# EAGLE design w65c265sxb_ym2149_rev1 (EAGLE 9.6.2)
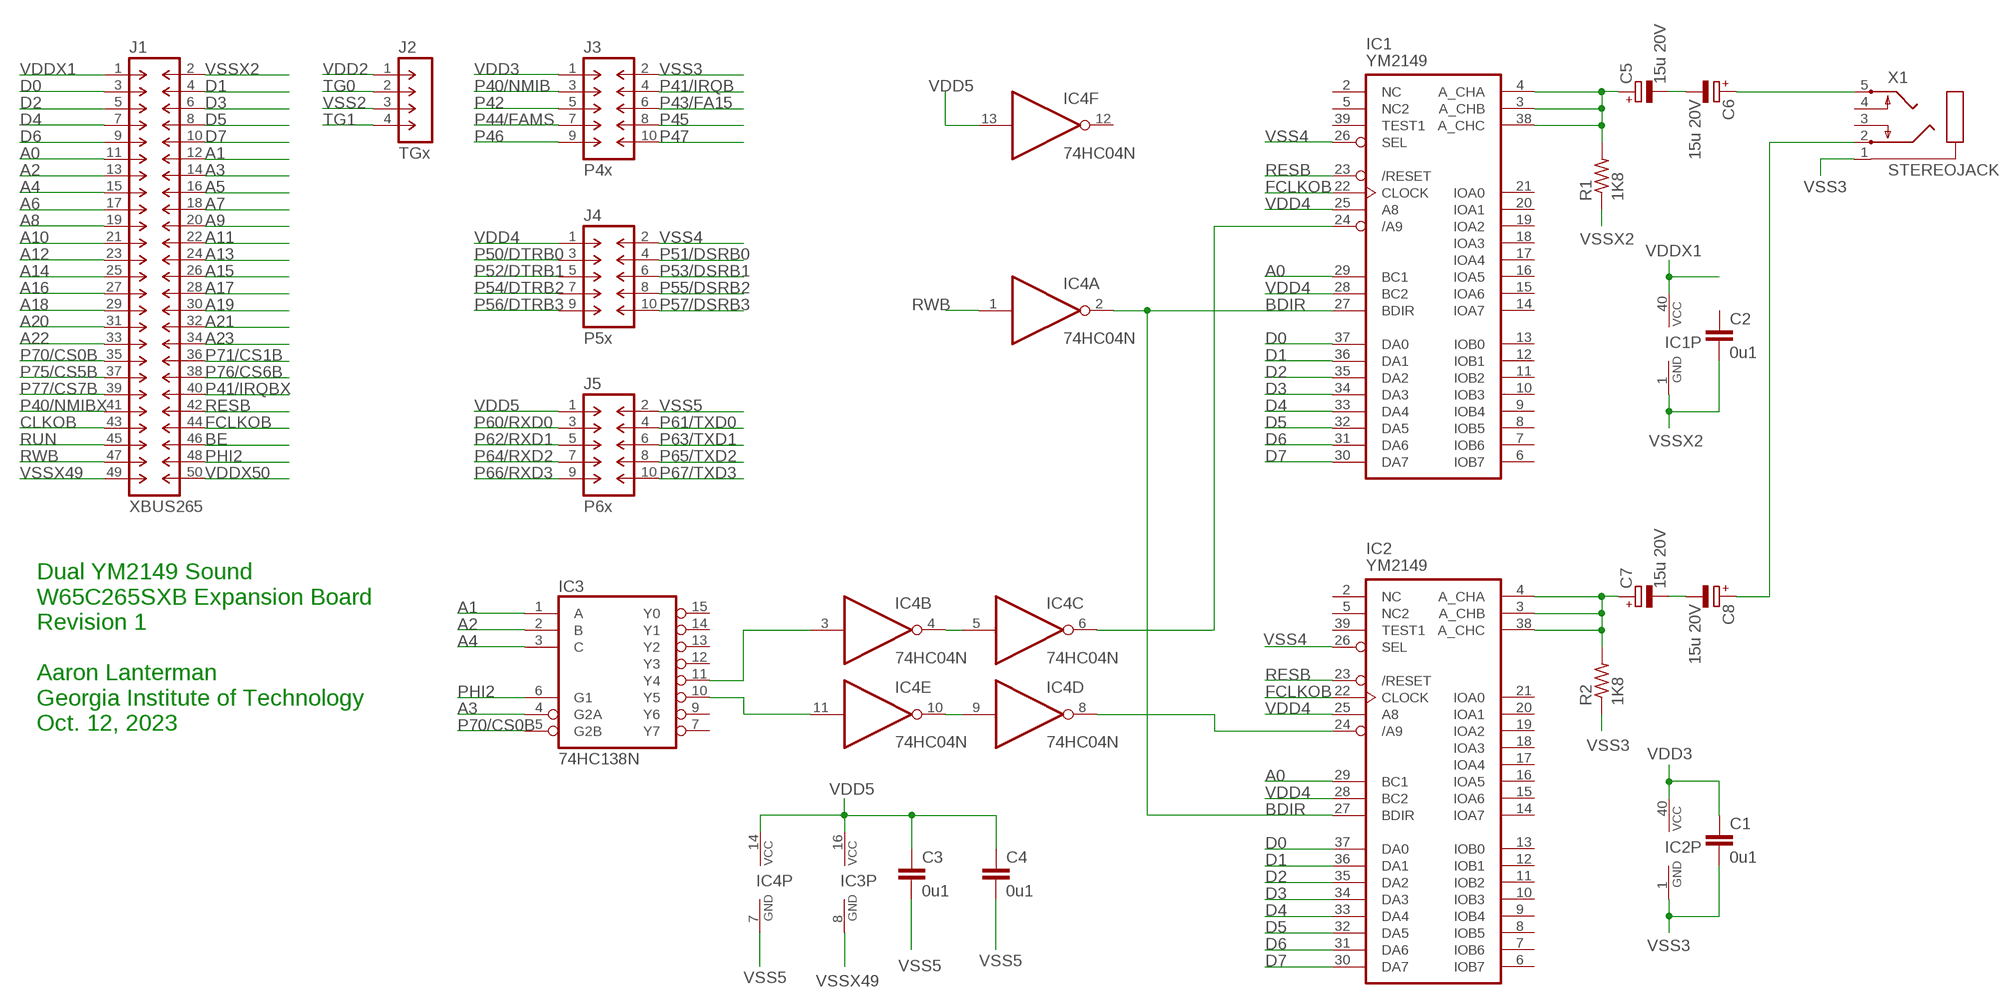
[diagram p0: schematic, sheet 1]

## Parts
C1  0u1  C-EU050-025X075-AARON  [C050-025X075-AARON]
C2  0u1  C-EU050-025X075-AARON  [C050-025X075-AARON]
C3  0u1  C-EU050-025X075-AARON  [C050-025X075-AARON]
C4  0u1  C-EU050-025X075-AARON  [C050-025X075-AARON]
C5  15u 20V  CPOL-EUE2.5-7  [E2,5-7]
C6  15u 20V  CPOL-EUE2.5-7  [E2,5-7]
C7  15u 20V  CPOL-EUE2.5-7  [E2,5-7]
C8  15u 20V  CPOL-EUE2.5-7  [E2,5-7]
IC1  YM2149  [DIL40]
IC2  YM2149  [DIL40]
IC3  74HC138N  [DIL16]
IC4  74HC04N  [DIL14]
J1  XBUS265  M-2X25-DIL-100  [DIL-100-2X25]
J2  TGx  M-1X04-SIP-100-40  [SIP-100-04-40]
J3  P4x  M-2X05-DIL-100  [DIL-100-2X05]
J4  P5x  M-2X05-DIL-100  [DIL-100-2X05]
J5  P6x  M-2X05-DIL-100  [DIL-100-2X05]
R1  1K8  R-US_0207/10  [0207/10]
R2  1K8  R-US_0207/10  [0207/10]
X1  STEREOJACK  [STX3100]

## Nets
A0: IC1.29(BC1) IC2.29(BC1) J1.11
A1: IC3.1(A) J1.12
A2: IC3.2(B) J1.13
A3: IC3.4(G2A) J1.14
A4: IC3.3(C) J1.15
A5: J1.16
A6: J1.17
A7: J1.18
A8: J1.19
A9: J1.20
A10: J1.21
A11: J1.22
A12: J1.23
A13: J1.24
A14: J1.25
A15: J1.26
A16: J1.27
A17: J1.28
A18: J1.29
A19: J1.30
A20: J1.31
A21: J1.32
A22: J1.33
A23: J1.34
BDIR: IC1.27(BDIR) IC2.27(BDIR) IC4.2(A:O)
BE: J1.46
CLKOB: J1.43
D0: IC1.37(DA0) IC2.37(DA0) J1.3
D1: IC1.36(DA1) IC2.36(DA1) J1.4
D2: IC1.35(DA2) IC2.35(DA2) J1.5
D3: IC1.34(DA3) IC2.34(DA3) J1.6
D4: IC1.33(DA4) IC2.33(DA4) J1.7
D5: IC1.32(DA5) IC2.32(DA5) J1.8
D6: IC1.31(DA6) IC2.31(DA6) J1.9
D7: IC1.30(DA7) IC2.30(DA7) J1.10
FCLKOB: IC1.22(CLOCK) IC2.22(CLOCK) J1.44
N$5: IC3.11(Y4) IC4.3(B:I)
N$6: IC4.4(B:O) IC4.5(C:I)
N$7: IC4.9(D:I) IC4.10(E:O)
N$8: IC1.24(/A9) IC4.6(C:O)
N$9: IC3.10(Y5) IC4.11(E:I)
N$10: C5.+ IC1.3(A_CHB) IC1.4(A_CHA) IC1.38(A_CHC) R1.2
N$11: C7.+ IC2.3(A_CHB) IC2.4(A_CHA) IC2.38(A_CHC) R2.2
N$12: IC2.24(/A9) IC4.8(D:O)
N$13: C5.- C6.-
N$14: C7.- C8.-
N$15: C6.+ X1.5
N$16: C8.+ X1.2
P40/NMIB: J3.3
P40/NMIBX: J1.41
P41/IRQB: J3.4
P41/IRQBX: J1.40
P42: J3.5
P43/FA15: J3.6
P44/FAMS: J3.7
P45: J3.8
P46: J3.9
P47: J3.10
P50/DTRB0: J4.3
P51/DSRB0: J4.4
P52/DTRB1: J4.5
P53/DSRB1: J4.6
P54/DTRB2: J4.7
P55/DSRB2: J4.8
P56/DTRB3: J4.9
P57/DSRB3: J4.10
P60/RXD0: J5.3
P61/TXD0: J5.4
P62/RXD1: J5.5
P63/TXD1: J5.6
P64/RXD2: J5.7
P65/TXD2: J5.8
P66/RXD3: J5.9
P67/TXD3: J5.10
P70/CS0B: IC3.5(G2B) J1.35
P71/CS1B: J1.36
P75/CS5B: J1.37
P76/CS6B: J1.38
P77/CS7B: J1.39
PHI2: IC3.6(G1) J1.48
RESB: IC1.23(/RESET) IC2.23(/RESET) J1.42
RUN: J1.45
RWB: IC4.1(A:I) J1.47
TG0: J2.2
TG1: J2.4
VDD2: J2.1
VDD3: C1.1 IC2.40(VCC) J3.1
VDD4: IC1.25(A8) IC1.28(BC2) IC2.25(A8) IC2.28(BC2) J4.1
VDD5: C3.1 C4.1 IC3.16(VCC) IC4.13(F:I) IC4.14(P:VCC) J5.1
VDDX1: IC1.40(VCC) J1.1
VDDX50: J1.50
VSS2: J2.3
VSS3: C1.2 IC2.1(GND) J3.2 R2.1 X1.1
VSS4: IC1.26(SEL) IC2.26(SEL) J4.2
VSS5: C3.2 C4.2 IC4.7(P:GND) J5.2
VSSX2: C2.2 IC1.1(GND) J1.2 R1.1
VSSX49: IC3.8(GND) J1.49
Unconnected: C2.1 IC1.2(NC) IC1.5(NC2) IC1.6(IOB7) IC1.7(IOB6) IC1.8(IOB5) IC1.9(IOB4) IC1.10(IOB3) IC1.11(IOB2) IC1.12(IOB1) IC1.13(IOB0) IC1.14(IOA7) IC1.15(IOA6) IC1.16(IOA5) IC1.17(IOA4) IC1.18(IOA3) IC1.19(IOA2) IC1.20(IOA1) IC1.21(IOA0) IC1.39(TEST1) IC2.2(NC) IC2.5(NC2) IC2.6(IOB7) IC2.7(IOB6) IC2.8(IOB5) IC2.9(IOB4) IC2.10(IOB3) IC2.11(IOB2) IC2.12(IOB1) IC2.13(IOB0) IC2.14(IOA7) IC2.15(IOA6) IC2.16(IOA5) IC2.17(IOA4) IC2.18(IOA3) IC2.19(IOA2) IC2.20(IOA1) IC2.21(IOA0) IC2.39(TEST1) IC3.7(Y7) IC3.9(Y6) IC3.12(Y3) IC3.13(Y2) IC3.14(Y1) IC3.15(Y0) IC4.12(F:O) X1.3 X1.4

## Notes on the sheet
- Dual YM2149 Sound
  W65C265SXB Expansion Board
  Revision 1
  
  Aaron Lanterman
  Georgia Institute of Technology
  Oct. 12, 2023

## Library data of the parts
C1-C4 = aaroncaps:C-EU: CAPACITOR, European symbol
C5-C8 = rcl:CPOL-EU: POLARIZED CAPACITOR, European symbol; SPICEPREFIX: C
IC1 IC2 = 1987computer:YM2149: Programmable sound generator
IC3 = 74xx-eu:74*138: 3-line to 8-line DECODER/DEMULTIPLEXER
IC4 = 74xx-eu:74*04: Hex INVERTER
J1 = con-headers-jp:M-2X25-: MALE HEADER
J2 = con-headers-jp:M-1X04-: MALE HEADER
J3-J5 = con-headers-jp:M-2X05-: MALE HEADER
R1 R2 = rcl:R-US_: RESISTOR, American symbol; SPICEPREFIX: R
X1 = adafruit:STEREOJACK: MIC/HEADPHONE JACK Stereo jack with two switches. Kycon STX3100, CUI SJ1-3555NG and/or 4UCon 05544

## Board
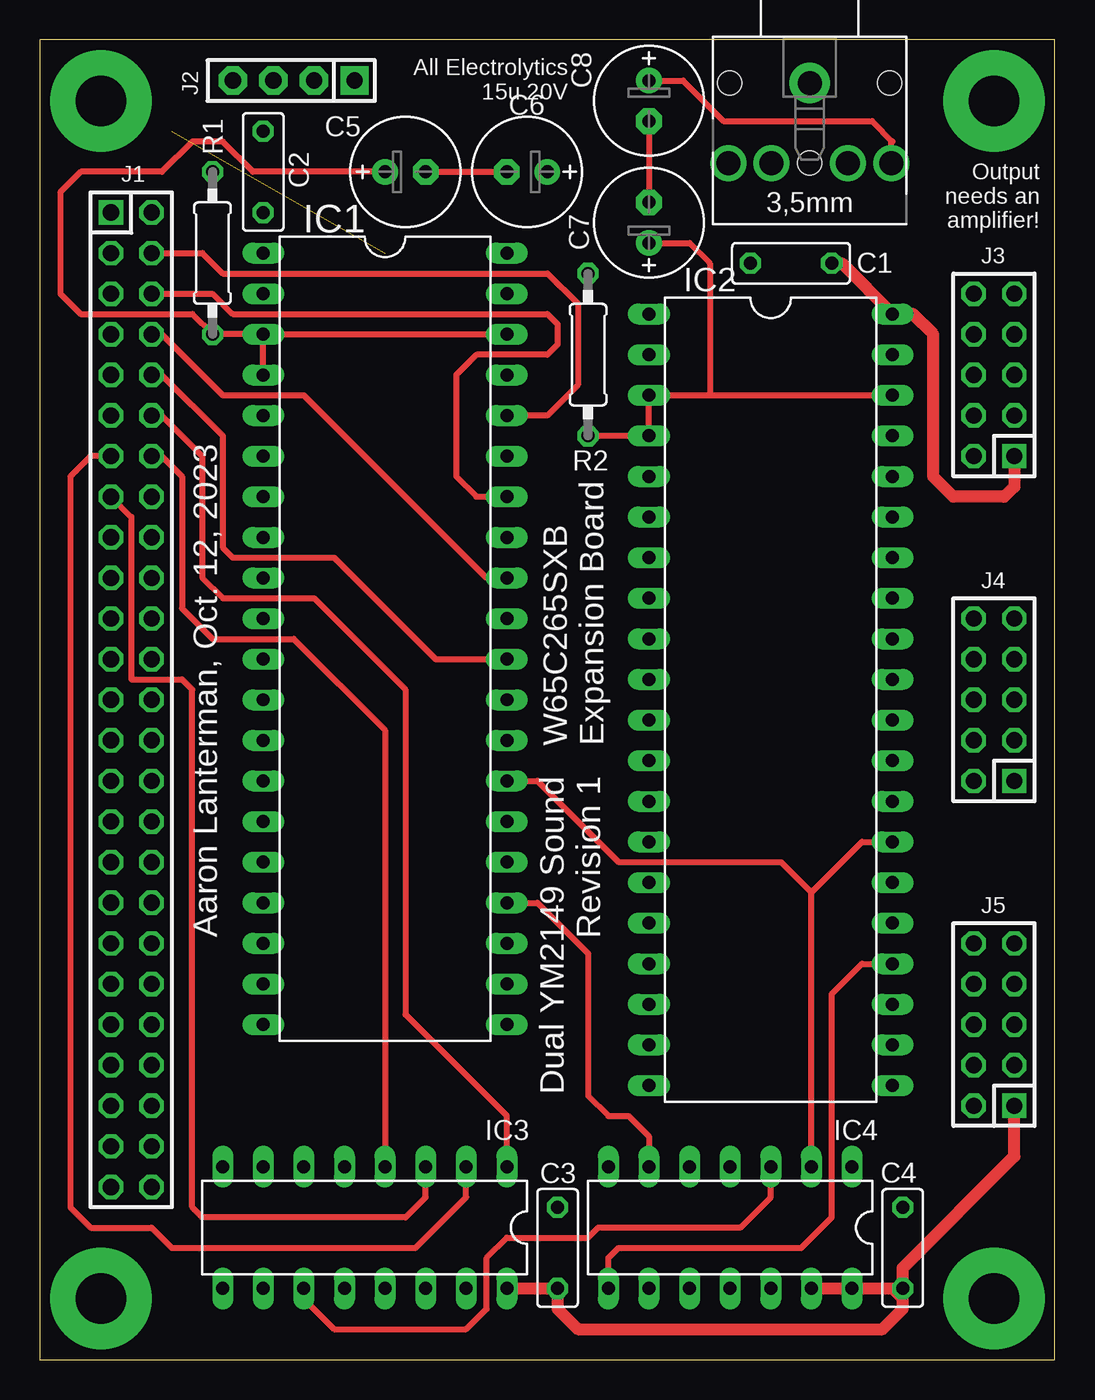
[diagram p1: board, top side]
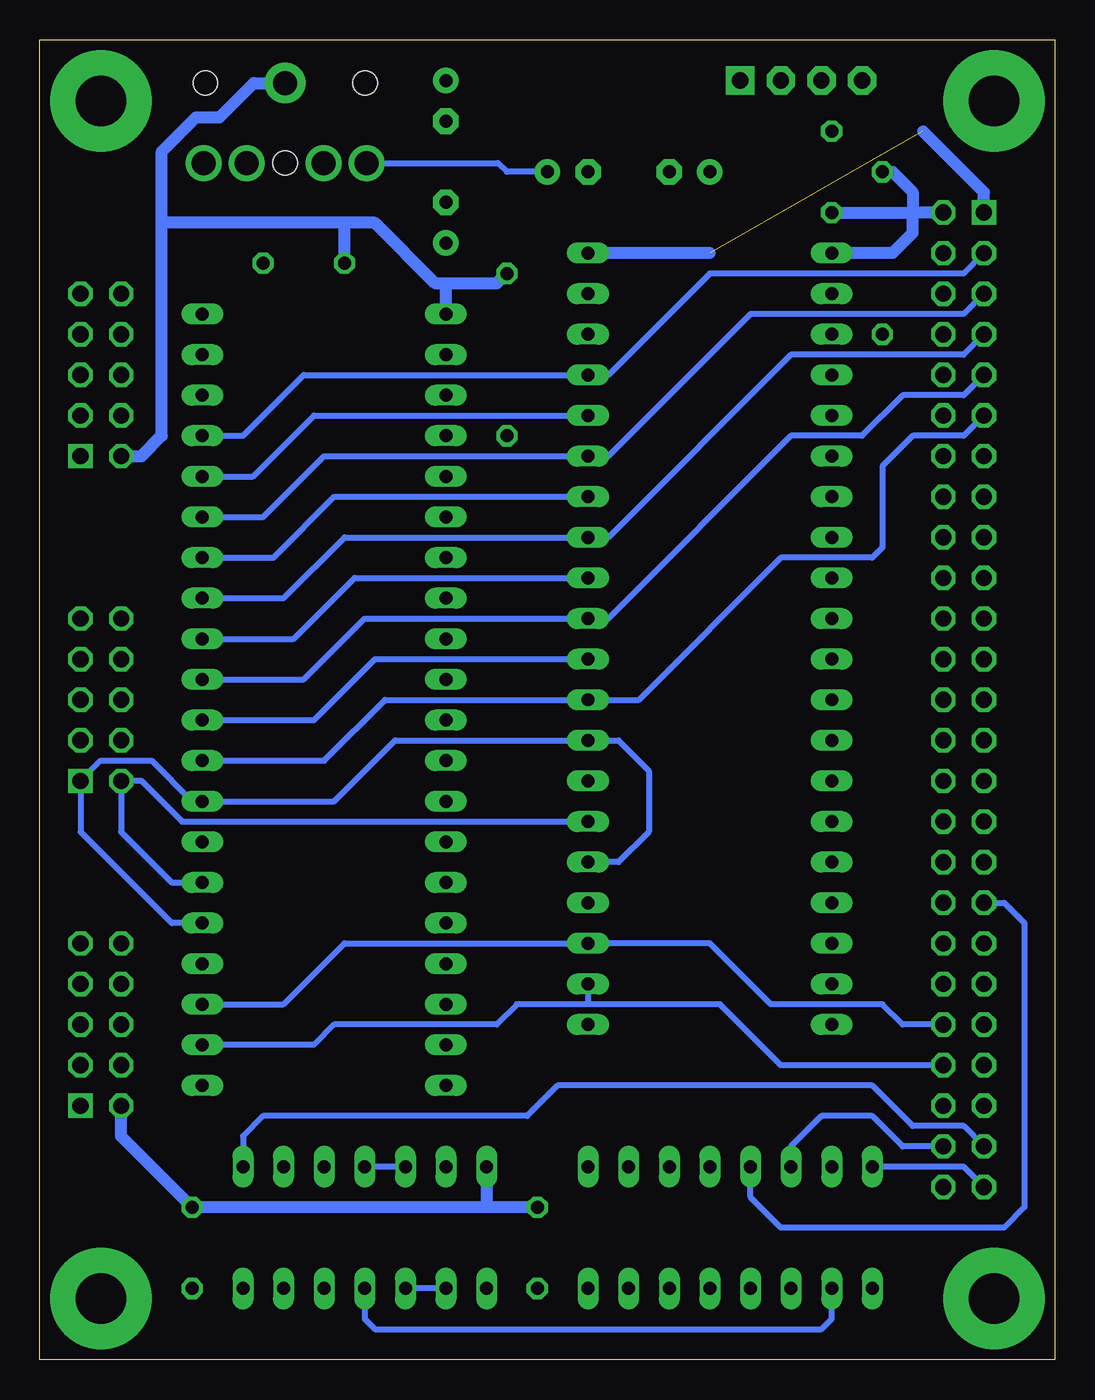
[diagram p2: board, bottom side, seen from below]

Size 63.5 x 82.55 mm. Coordinates in mm from the lower left corner, seen from the top.
Outline: 0,0 63.5,0 63.5,82.55 0,82.55 0,0
Copper layers (1*16): Top 0.035mm / dielectric 1.5mm / Bottom 0.035mm
Design rules "InventionStudioDesignRules": minimum track width 10mil, minimum drill 0.4mm, track to track 10mil, track to pad 10mil, pad to pad 10mil, via to via 10mil, smd to smd 10mil, copper to edge 40mil, drill to drill 6mil, minimum pad ring 10mil, minimum via ring 8mil, stop-mask expansion 4mil, vias tented up to drill 0mil, thermal gap 10mil

### Footprints (pad centres in the part's own frame; a part is rotated, then mirrored left to right if it is on the bottom)
C050-025X075-AARON = drill 0.813 octagon: 1 -2.54,0; 2 2.54,0
E2,5-7 = drill 0.813 pad 1.6: + -1.27,0 | drill 0.813 pad 1.6 octagon: - 1.27,0
DIL40 = drill 0.813 long: 1 -24.13,-7.62; 2 -21.59,-7.62; 3 -19.05,-7.62; 4 -16.51,-7.62; 5 -13.97,-7.62; 6 -11.43,-7.62; 7 -8.89,-7.62; 8 -6.35,-7.62; 9 -3.81,-7.62; 10 -1.27,-7.62; 11 1.27,-7.62; 12 3.81,-7.62; 13 6.35,-7.62; 14 8.89,-7.62; 15 11.43,-7.62; 16 13.97,-7.62; 17 16.51,-7.62; 18 19.05,-7.62; 19 21.59,-7.62; 20 24.13,-7.62; 21 24.13,7.62; 22 21.59,7.62; 23 19.05,7.62; 24 16.51,7.62; 25 13.97,7.62; 26 11.43,7.62; 27 8.89,7.62; 28 6.35,7.62; 29 3.81,7.62; 30 1.27,7.62; 31 -1.27,7.62; 32 -3.81,7.62; 33 -6.35,7.62; 34 -8.89,7.62; 35 -11.43,7.62; 36 -13.97,7.62; 37 -16.51,7.62; 38 -19.05,7.62; 39 -21.59,7.62; 40 -24.13,7.62
DIL16 = drill 0.813 long: 1 -8.89,-3.81; 2 -6.35,-3.81; 3 -3.81,-3.81; 4 -1.27,-3.81; 5 1.27,-3.81; 6 3.81,-3.81; 7 6.35,-3.81; 8 8.89,-3.81; 9 8.89,3.81; 10 6.35,3.81; 11 3.81,3.81; 12 1.27,3.81; 13 -1.27,3.81; 14 -3.81,3.81; 15 -6.35,3.81; 16 -8.89,3.81
DIL14 = drill 0.813 long: 1 -7.62,-3.81; 2 -5.08,-3.81; 3 -2.54,-3.81; 4 0,-3.81; 5 2.54,-3.81; 6 5.08,-3.81; 7 7.62,-3.81; 8 7.62,3.81; 9 5.08,3.81; 10 2.54,3.81; 11 0,3.81; 12 -2.54,3.81; 13 -5.08,3.81; 14 -7.62,3.81
DIL-100-2X25 = drill 1.016 square: 1 -30.48,-1.27 | drill 1.016 octagon: 2 -30.48,1.27; 3 -27.94,-1.27; 4 -27.94,1.27; 5 -25.4,-1.27; 6 -25.4,1.27; 7 -22.86,-1.27; 8 -22.86,1.27; 9 -20.32,-1.27; 10 -20.32,1.27; 11 -17.78,-1.27; 12 -17.78,1.27; 13 -15.24,-1.27; 14 -15.24,1.27; 15 -12.7,-1.27; 16 -12.7,1.27; 17 -10.16,-1.27; 18 -10.16,1.27; 19 -7.62,-1.27; 20 -7.62,1.27; 21 -5.08,-1.27; 22 -5.08,1.27; 23 -2.54,-1.27; 24 -2.54,1.27; 25 0,-1.27; 26 0,1.27; 27 2.54,-1.27; 28 2.54,1.27; 29 5.08,-1.27; 30 5.08,1.27; 31 7.62,-1.27; 32 7.62,1.27; 33 10.16,-1.27; 34 10.16,1.27; 35 12.7,-1.27; 36 12.7,1.27; 37 15.24,-1.27; 38 15.24,1.27; 39 17.78,-1.27; 40 17.78,1.27; 41 20.32,-1.27; 42 20.32,1.27; 43 22.86,-1.27; 44 22.86,1.27; 45 25.4,-1.27; 46 25.4,1.27; 47 27.94,-1.27; 48 27.94,1.27; 49 30.48,-1.27; 50 30.48,1.27
SIP-100-04-40 = drill 1.016 pad 1.778 square: 1 -3.81,0 | drill 1.016 pad 1.778 octagon: 2 -1.27,0; 3 1.27,0; 4 3.81,0
DIL-100-2X05 = drill 1.016 square: 1 -5.08,-1.27 | drill 1.016 octagon: 2 -5.08,1.27; 3 -2.54,-1.27; 4 -2.54,1.27; 5 0,-1.27; 6 0,1.27; 7 2.54,-1.27; 8 2.54,1.27; 9 5.08,-1.27; 10 5.08,1.27
0207/10 = drill 0.813 octagon: 1 -5.08,0; 2 5.08,0
STX3100 = drill 1.5 pad 2.54: 1 2.7,-0.1 | drill 1.5: 2 7.7,5; 3 7.7,2.3; 4 7.7,-2.5; 5 7.7,-5.2 | hole 1.5: 2.7,4.9; 2.7,-5.1; 7.7,-0.1

### Placement (x,y rotation side)
C1  46.99,68.58 180 top
C2  13.97,74.3 270 top
C3  32.38,6.99 90 top
C4  53.98,6.99 90 top
C5  22.86,74.3 0 top
C6  30.48,74.3 180 top
C7  38.1,71.12 90 top
C8  38.1,78.74 270 top
IC1  21.59,45.09 270 top
IC2  45.72,41.27 270 top
IC3  20.32,8.26 180 top
IC4  43.18,8.26 180 top
J1  5.71,41.27 270 top
J2  15.88,80.01 180 top
J3  59.69,61.59 90 top
J4  59.69,41.27 90 top
J5  59.69,20.95 90 top
R1  10.79,69.22 270 top
R2  34.29,62.87 270 top
X1  48.26,82.55 270 top

### Tracks (layer width: path | path; a pad name or v marks a point on that pad's centre or on a via)
A0
  Bottom 0.381: IC2.29 45.72,37.47 41.91,41.27 IC1.29 26.04,41.27 17.14,50.16 11.43,50.16 10.79,50.8 10.79,55.88 8.89,57.78 5.71,57.78 J1.11
A1
  Top 0.381: J1.12 7.62,59.05 10.16,56.52 10.16,48.9 11.43,47.62 17.14,47.62 22.86,41.91 22.86,21.59 29.21,15.24 IC3.1
A2
  Top 0.381: J1.13 3.17,56.52 1.91,55.24 1.91,9.53 3.17,8.26 6.99,8.26 8.26,6.99 23.5,6.99 26.67,10.16 IC3.2
A3
  Top 0.381: J1.14 7.62,56.52 8.89,55.24 8.89,46.99 10.79,45.09 15.88,45.09 21.59,39.37 IC3.4
A4
  Top 0.381: J1.15 5.71,52.7 5.71,42.55 8.89,42.55 9.53,41.91 9.53,9.53 10.16,8.89 22.86,8.89 24.13,10.16 IC3.3
BDIR
  Top 0.381: IC4.2 48.26,29.21 | IC2.27 51.44,32.38 48.26,29.21 | IC1.27 31.11,36.2 36.2,31.11 46.35,31.11 48.26,29.21
D0
  Bottom 0.381: IC2.37 50.8,57.78 46.99,61.59 IC1.37 27.94,61.59 21.59,67.94 5.71,67.94 J1.3
D1
  Top 0.381: J1.4 10.16,69.22 11.43,67.94 31.75,67.94 33.66,66.04 33.66,60.96 31.75,59.05 IC1.36
  Bottom 0.381: IC2.36 50.16,55.24 46.35,59.05 IC1.36
D2
  Bottom 0.381: IC2.35 49.53,52.7 45.72,56.52 IC1.35 27.94,56.52 19.05,65.41 5.71,65.41 J1.5
D3
  Top 0.381: J1.6 10.79,66.67 12.06,65.41 31.75,65.41 32.38,64.77 32.38,63.5 31.75,62.87 27.3,62.87 26.04,61.59 26.04,55.24 27.3,53.98 IC1.34
  Bottom 0.381: IC2.34 48.9,50.16 45.09,53.98 IC1.34
D4
  Bottom 0.381: IC2.33 48.26,47.62 44.45,51.44 IC1.33 27.94,51.44 16.51,62.87 5.71,62.87 J1.7
D5
  Top 0.381: IC1.32 27.94,48.9 16.51,60.33 11.43,60.33 7.62,64.14 J1.8
  Bottom 0.381: IC2.32 47.62,45.09 43.81,48.9 IC1.32
D6
  Bottom 0.381: IC2.31 46.99,42.55 43.18,46.35 IC1.31 27.94,46.35 16.51,57.78 12.06,57.78 9.53,60.33 5.71,60.33 J1.9
D7
  Top 0.381: IC1.30 24.77,43.81 18.41,50.16 12.06,50.16 11.43,50.8 11.43,57.78 7.62,61.59 J1.10
  Bottom 0.381: IC2.30 46.35,40.01 42.55,43.81 IC1.30
FCLKOB
  Bottom 0.381: J1.44 17.14,18.41 20.95,22.23 29.21,22.23 | 29.21,22.23 33.66,22.23 34.92,20.95 45.09,20.95 46.35,19.68 IC2.22 | IC1.22 29.21,22.23
N$1  (via drill 3.17 pad 6.35)
  other vias: 3.81,3.81
N$2  (via drill 3.17 pad 6.35)
  other vias: 59.69,3.81
N$3  (via drill 3.17 pad 6.35)
  other vias: 59.69,78.74
N$4  (via drill 3.17 pad 6.35)
  other vias: 3.81,78.74
N$5
  Top 0.381: IC3.11 16.51,3.81 18.41,1.91 26.67,1.91 27.94,3.17 27.94,6.35 29.21,7.62 34.29,7.62 34.92,8.26 43.81,8.26 45.72,10.16 IC4.3
N$6
  Bottom 0.381: IC4.5 IC4.4
N$7
  Bottom 0.381: IC4.9 IC4.10
N$8
  Top 0.381: IC1.24 31.11,28.57 34.29,25.4 34.29,16.51 35.56,15.24 36.83,15.24 38.1,13.97 IC4.6
N$9
  Bottom 0.381: IC4.11 43.18,2.54 42.55,1.91 14.61,1.91 13.97,2.54 IC3.10
N$10
  Top 0.381: IC1.4 IC1.3 | IC1.3 R1.2 9.53,65.41 2.54,65.41 1.27,66.67 1.27,73.03 2.54,74.3 7.62,74.3 9.53,76.2 11.43,76.2 13.34,74.3 C5.+ | IC1.3 IC1.38
N$11
  Top 0.381: R2.2 IC2.4 IC2.3 41.91,60.33 | 41.91,60.33 IC2.38 | C7.+ 40.64,69.85 41.91,68.58 41.91,60.33
N$12
  Top 0.381: IC4.8 35.56,6.35 36.2,6.99 47.62,6.99 49.53,8.89 49.53,22.86 51.44,24.77 IC2.24
N$13
  Top 0.381: C5.- C6.-
N$14
  Top 0.381: C8.- C7.-
N$15
  Bottom 0.381: X1.5 34.84,74.85 34.29,74.3 C6.+
N$16
  Top 0.381: X1.2 53.26,76.12 53.34,76.2 52.07,77.47 42.77,77.47 40.23,80.01 C8.+
P70/CS0B
  Bottom 0.381: J1.35 3.17,28.57 1.91,27.3 1.91,9.53 3.17,8.26 17.14,8.26 19.05,10.16 IC3.5
PHI2
  Bottom 0.381: J1.48 9.53,13.34 11.43,15.24 14.61,15.24 16.51,13.34 IC3.6
RESB
  Bottom 0.381: IC2.23 48.26,22.23 44.45,26.04 IC1.23 21.59,26.04 17.78,22.23 10.79,22.23 9.53,20.95 J1.42
RWB
  Bottom 0.381: J1.47 5.71,14.61 8.89,14.61 11.43,17.14 31.11,17.14 33.02,15.24 49.53,15.24 50.8,13.97 IC4.1
VDD3
  Top 0.762: J3.1 60.96,54.61 60.33,53.98 57.15,53.98 55.88,55.24 55.88,64.14 54.61,65.41 IC2.40 50.16,68.58 C1.1
VDD4
  Bottom 0.381: IC1.25 27.3,31.11 25.4,33.02 25.4,36.83 27.3,38.73 IC1.28 41.27,38.73 45.09,34.92 IC2.28 53.98,34.92 56.52,37.47 59.69,37.47 J4.1 60.96,35.56 60.96,33.02 55.24,27.3 IC2.25
VDD5
  Top 0.762: IC3.16 C3.1 32.38,3.17 33.66,1.91 52.7,1.91 53.98,3.17 53.98,3.81 | 53.98,3.81 C4.1 53.98,5.71 60.96,12.7 J5.1 | 53.98,3.81 53.34,4.45 IC4.14 IC4.13
VDDX1  (1 unrouted)
  Bottom 0.762: J1.1 4.45,73.03 8.26,76.83 | 21.59,69.22 IC1.40
VSS3
  Bottom 0.762: J3.2 57.15,56.52 55.88,57.78 55.88,71.12 | 55.88,71.12 55.88,75.56 53.74,77.7 52.27,77.7 50.12,79.85 X1.1 | 44.45,71.12 42.55,71.12 38.73,67.31 38.1,67.31 | 44.45,71.12 55.88,71.12 | R2.1 34.92,67.31 38.1,67.31 | C1.2 44.45,71.12 | IC2.1 38.1,67.31
VSS4
  Bottom 0.381: IC1.26 54.61,33.66 57.15,36.2 J4.2 58.42,33.02 55.24,29.84 IC2.26
VSS5
  Bottom 0.762: C3.2 35.56,9.53 | 35.56,9.53 C4.2 58.42,13.97 J5.2 | IC4.7 35.56,9.53
VSSX2
  Bottom 0.762: IC1.1 10.16,69.22 8.89,70.48 8.89,71.75 | R1.1 10.16,74.3 8.89,73.03 8.89,71.75 | C2.2 8.89,71.75 | J1.2 8.89,71.75
VSSX49
  Bottom 0.381: J1.49 5.71,12.06 IC3.8

### Text on the board
tNames: All Electrolytics / 15u 20V | Output / needs an / amplifier! | W65C265SXB / Expansion Board | Dual YM2149 Sound / Revision 1 | Aaron Lanterman, Oct. 12, 2023